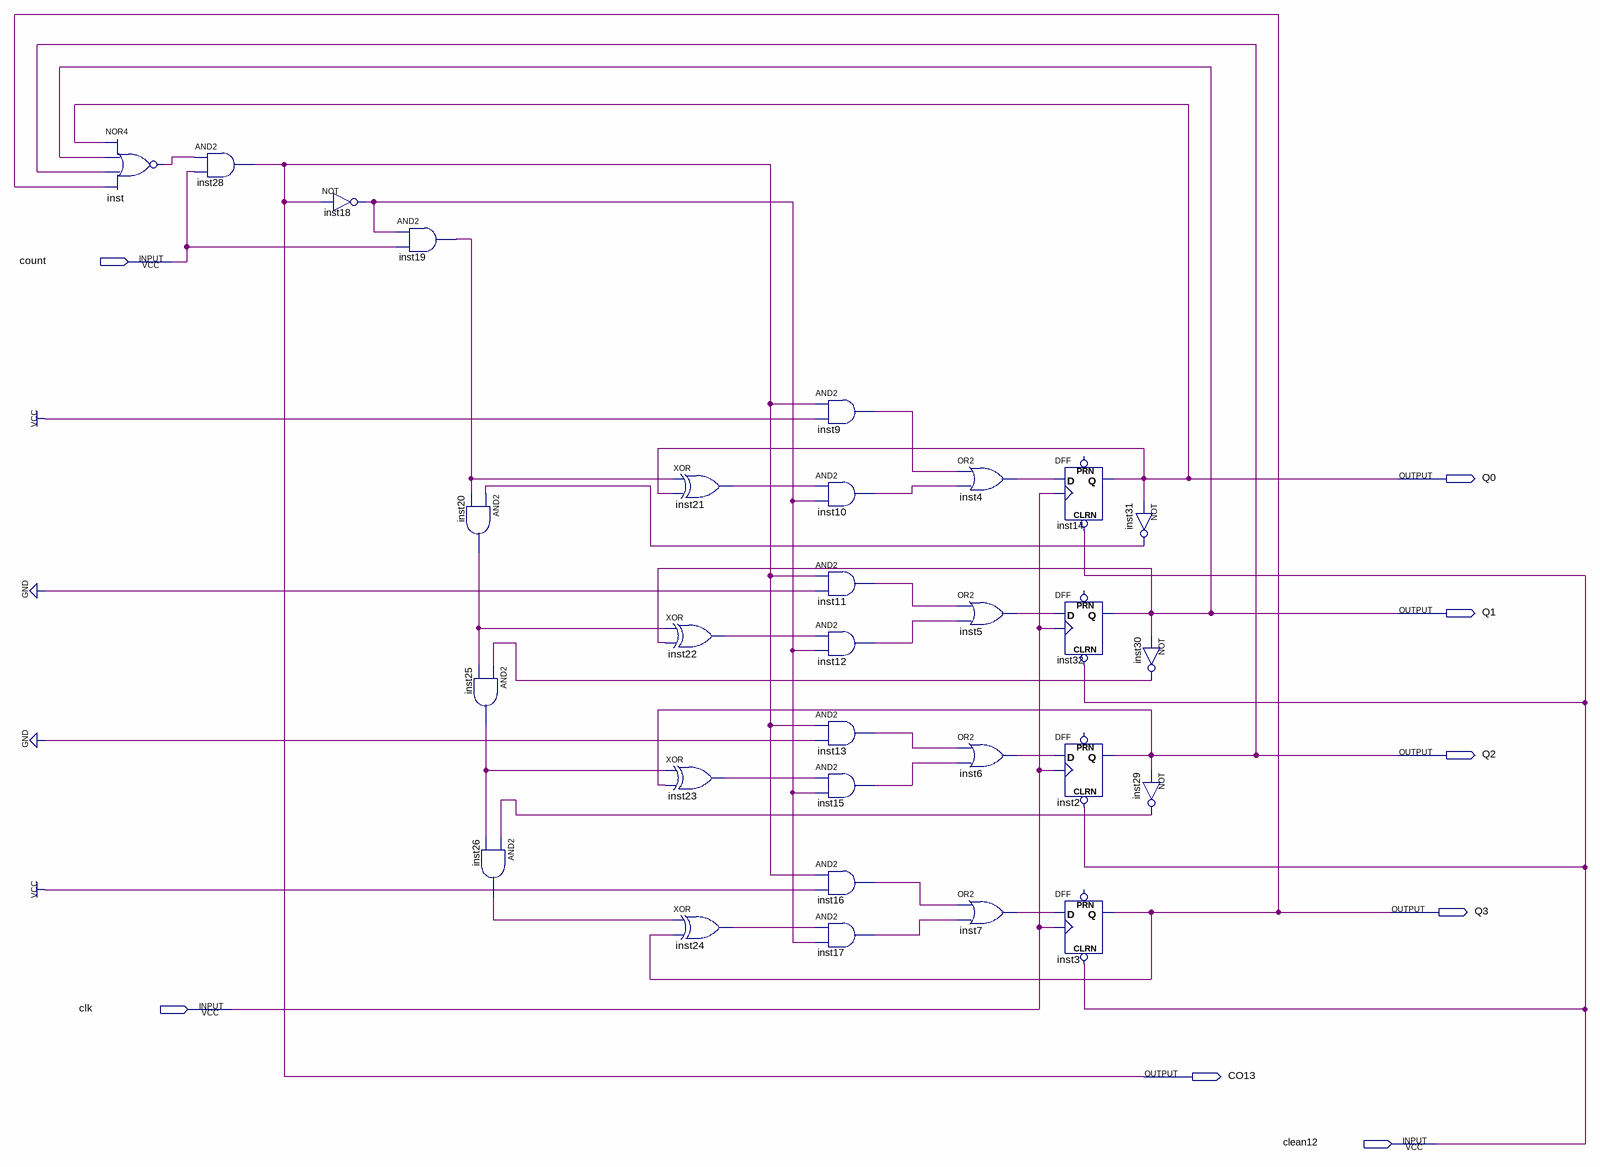
[diagram p0: schematic sheet]
// Quartus schematic bcd.bdf as structural Verilog: 30 symbols, 8 pins
module bcd (
  input  count,
  input  clk,
  input  clean12,
  output Q0,
  output Q1,
  output Q2,
  output Q3,
  output CO13
);

  wire inst4_out, inst5_out, inst6_out, inst7_out, inst9_out, inst10_out, inst11_out, inst12_out, inst13_out,
       inst15_out, inst16_out, inst17_out, inst18_out, inst19_out, inst20_out, inst21_out, inst22_out,
       inst23_out, inst24_out, inst25_out, inst26_out, inst29_out, inst30_out, inst31_out, inst_out;

  nor inst (inst_out, Q0, Q1, Q2, Q3);
  and inst28 (CO13, inst_out, count);
  not inst18 (inst18_out, CO13);
  and inst19 (inst19_out, inst18_out, count);
  and inst20 (inst20_out, inst31_out, inst19_out);
  and inst25 (inst25_out, inst30_out, inst20_out);
  and inst26 (inst26_out, inst29_out, inst25_out);
  xor inst21 (inst21_out, inst19_out, Q0);
  xor inst22 (inst22_out, inst20_out, Q1);
  xor inst23 (inst23_out, inst25_out, Q2);
  xor inst24 (inst24_out, inst26_out, Q3);
  and inst9 (inst9_out, CO13, 1'b1);
  and inst10 (inst10_out, inst21_out, inst18_out);
  and inst11 (inst11_out, CO13, 1'b0);
  and inst12 (inst12_out, inst22_out, inst18_out);
  and inst13 (inst13_out, CO13, 1'b0);
  and inst15 (inst15_out, inst23_out, inst18_out);
  and inst16 (inst16_out, CO13, 1'b1);
  and inst17 (inst17_out, inst24_out, inst18_out);
  or inst4 (inst4_out, inst9_out, inst10_out);
  or inst5 (inst5_out, inst11_out, inst12_out);
  or inst6 (inst6_out, inst13_out, inst15_out);
  or inst7 (inst7_out, inst16_out, inst17_out);
  DFF inst14 (.CLRN(clean12), .CLK(clk), .D(inst4_out), .Q(Q0));  // open: PRN
  DFF inst32 (.CLRN(clean12), .CLK(clk), .D(inst5_out), .Q(Q1));  // open: PRN
  DFF inst2 (.CLRN(clean12), .CLK(clk), .D(inst6_out), .Q(Q2));  // open: PRN
  DFF inst3 (.CLRN(clean12), .CLK(clk), .D(inst7_out), .Q(Q3));  // open: PRN
  not inst31 (inst31_out, Q0);
  not inst30 (inst30_out, Q1);
  not inst29 (inst29_out, Q2);
endmodule
